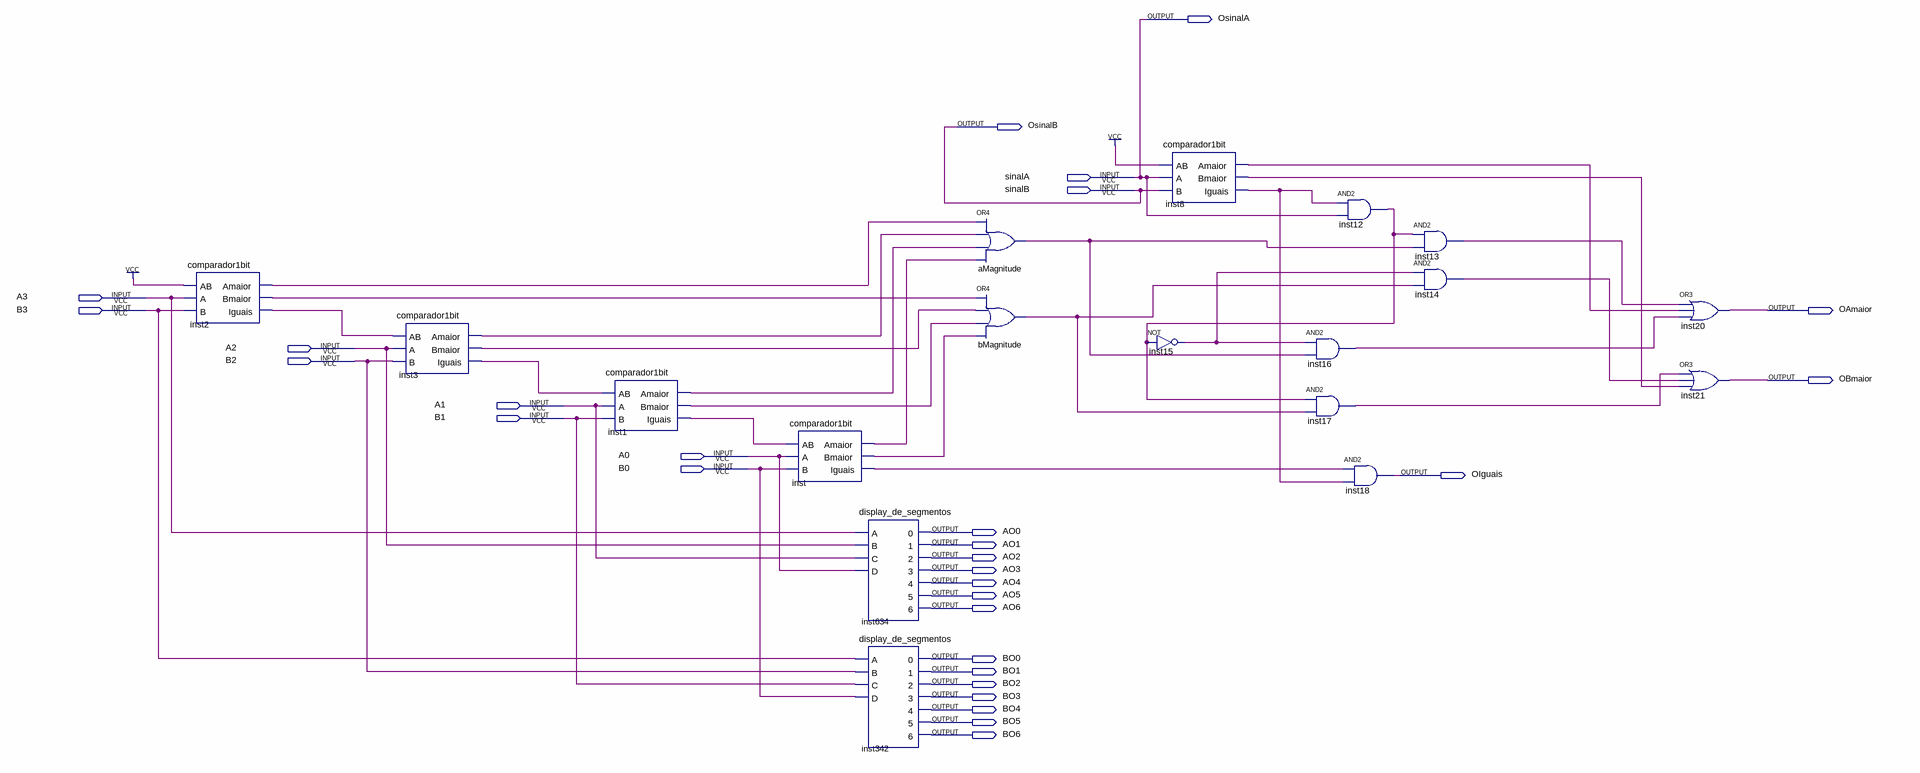
[diagram p0: schematic sheet]
// Quartus schematic comparador4bit.bdf as structural Verilog: 18 symbols, 29 pins
module comparador4bit (
  input  sinalA,
  input  sinalB,
  input  A3,
  input  B3,
  input  A2,
  input  B2,
  input  A1,
  input  B1,
  input  A0,
  input  B0,
  output OsinalA,
  output OsinalB,
  output OAmaior,
  output OBmaior,
  output OIguais,
  output AO0,
  output AO1,
  output AO2,
  output AO3,
  output AO4,
  output AO5,
  output AO6,
  output BO0,
  output BO1,
  output BO2,
  output BO3,
  output BO4,
  output BO5,
  output BO6
);

  wire aMagnitude_out, bMagnitude_out, inst1_amaior, inst1_bmaior, inst1_iguais, inst2_amaior, inst2_bmaior,
       inst2_iguais, inst3_amaior, inst3_bmaior, inst3_iguais, inst8_amaior, inst8_bmaior, inst8_iguais,
       inst12_out, inst13_out, inst14_out, inst15_out, inst16_out, inst17_out, inst_amaior, inst_bmaior,
       inst_iguais;

  comparador1bit inst2 (.AB(1'b1), .A(A3), .B(B3), .Amaior(inst2_amaior), .Bmaior(inst2_bmaior), .Iguais(inst2_iguais));
  comparador1bit inst3 (
    .AB(inst2_iguais), .A(A2), .B(B2), .Amaior(inst3_amaior), .Bmaior(inst3_bmaior), .Iguais(inst3_iguais));
  comparador1bit inst1 (
    .AB(inst3_iguais), .A(A1), .B(B1), .Amaior(inst1_amaior), .Bmaior(inst1_bmaior), .Iguais(inst1_iguais));
  comparador1bit inst (
    .AB(inst1_iguais), .A(A0), .B(B0), .Amaior(inst_amaior), .Bmaior(inst_bmaior), .Iguais(inst_iguais));
  display_de_segmentos inst634 (
    .A(A3), .B(A2), .C(A1), .D(A0), .\0 (AO0), .\1 (AO1), .\2 (AO2), .\3 (AO3), .\4 (AO4), .\5 (AO5),
    .\6 (AO6));
  display_de_segmentos inst342 (
    .A(B3), .B(B2), .C(B1), .D(B0), .\0 (BO0), .\1 (BO1), .\2 (BO2), .\3 (BO3), .\4 (BO4), .\5 (BO5),
    .\6 (BO6));
  or aMagnitude (aMagnitude_out, inst2_amaior, inst3_amaior, inst1_amaior, inst_amaior);
  or bMagnitude (bMagnitude_out, inst2_bmaior, inst3_bmaior, inst1_bmaior, inst_bmaior);
  comparador1bit inst8 (
    .AB(1'b1), .A(sinalA), .B(sinalB), .Amaior(inst8_amaior), .Bmaior(inst8_bmaior), .Iguais(inst8_iguais));
  not inst15 (inst15_out, inst12_out);
  and inst16 (inst16_out, inst15_out, aMagnitude_out);
  and inst17 (inst17_out, inst12_out, bMagnitude_out);
  and inst12 (inst12_out, inst8_iguais, sinalA);
  and inst18 (OIguais, inst_iguais, inst8_iguais);
  and inst13 (inst13_out, inst12_out, aMagnitude_out);
  and inst14 (inst14_out, inst15_out, bMagnitude_out);
  or inst20 (OAmaior, inst13_out, inst8_amaior, inst16_out);
  or inst21 (OBmaior, inst17_out, inst14_out, inst8_bmaior);

  assign OsinalA = sinalA;
  assign OsinalB = sinalB;
endmodule
